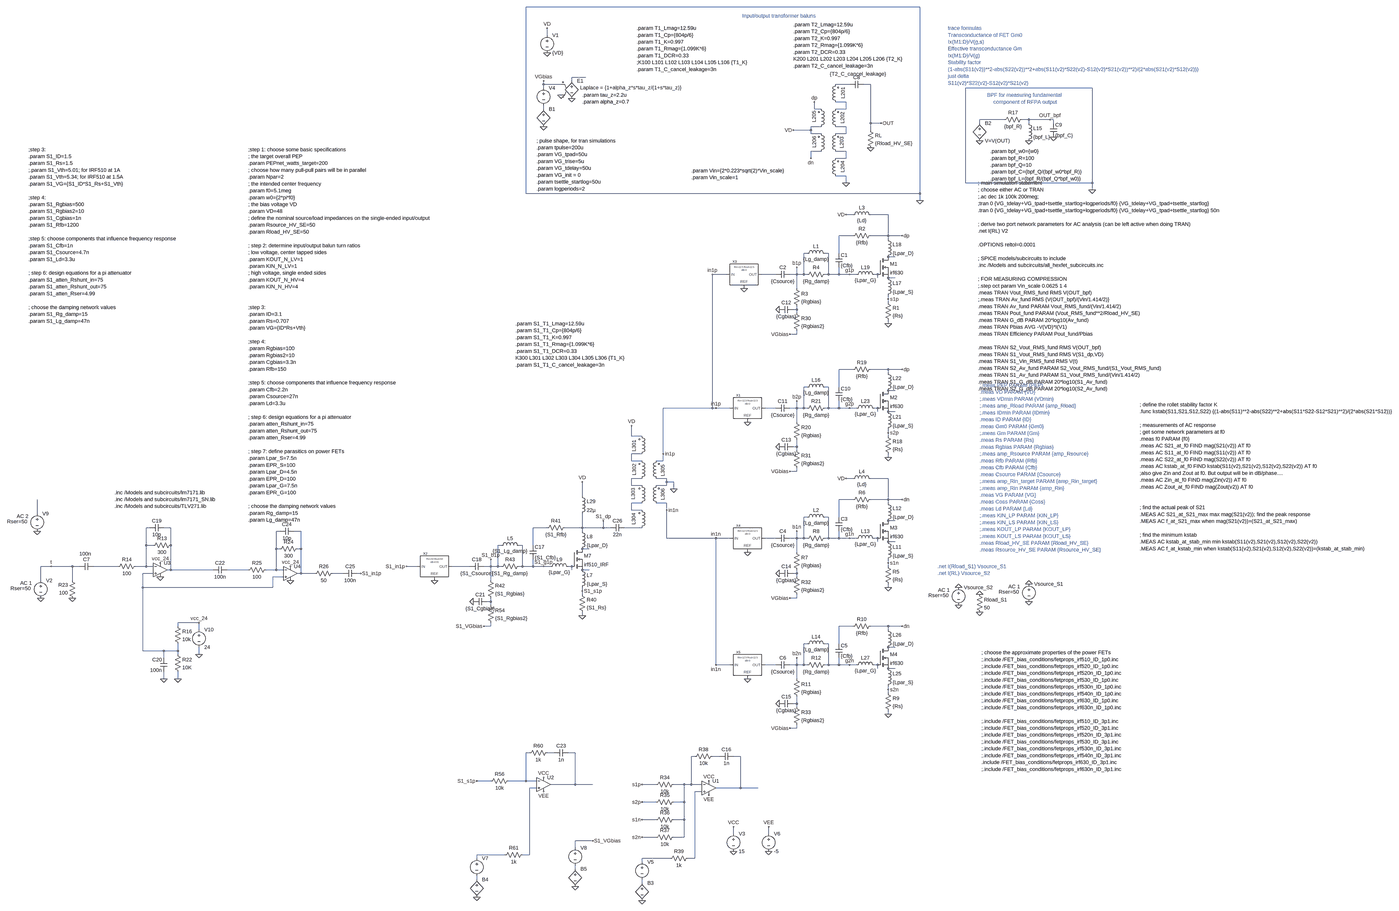
[diagram p0: schematic Easy_RFPA_RevC_seS1.asc, whole sheet]
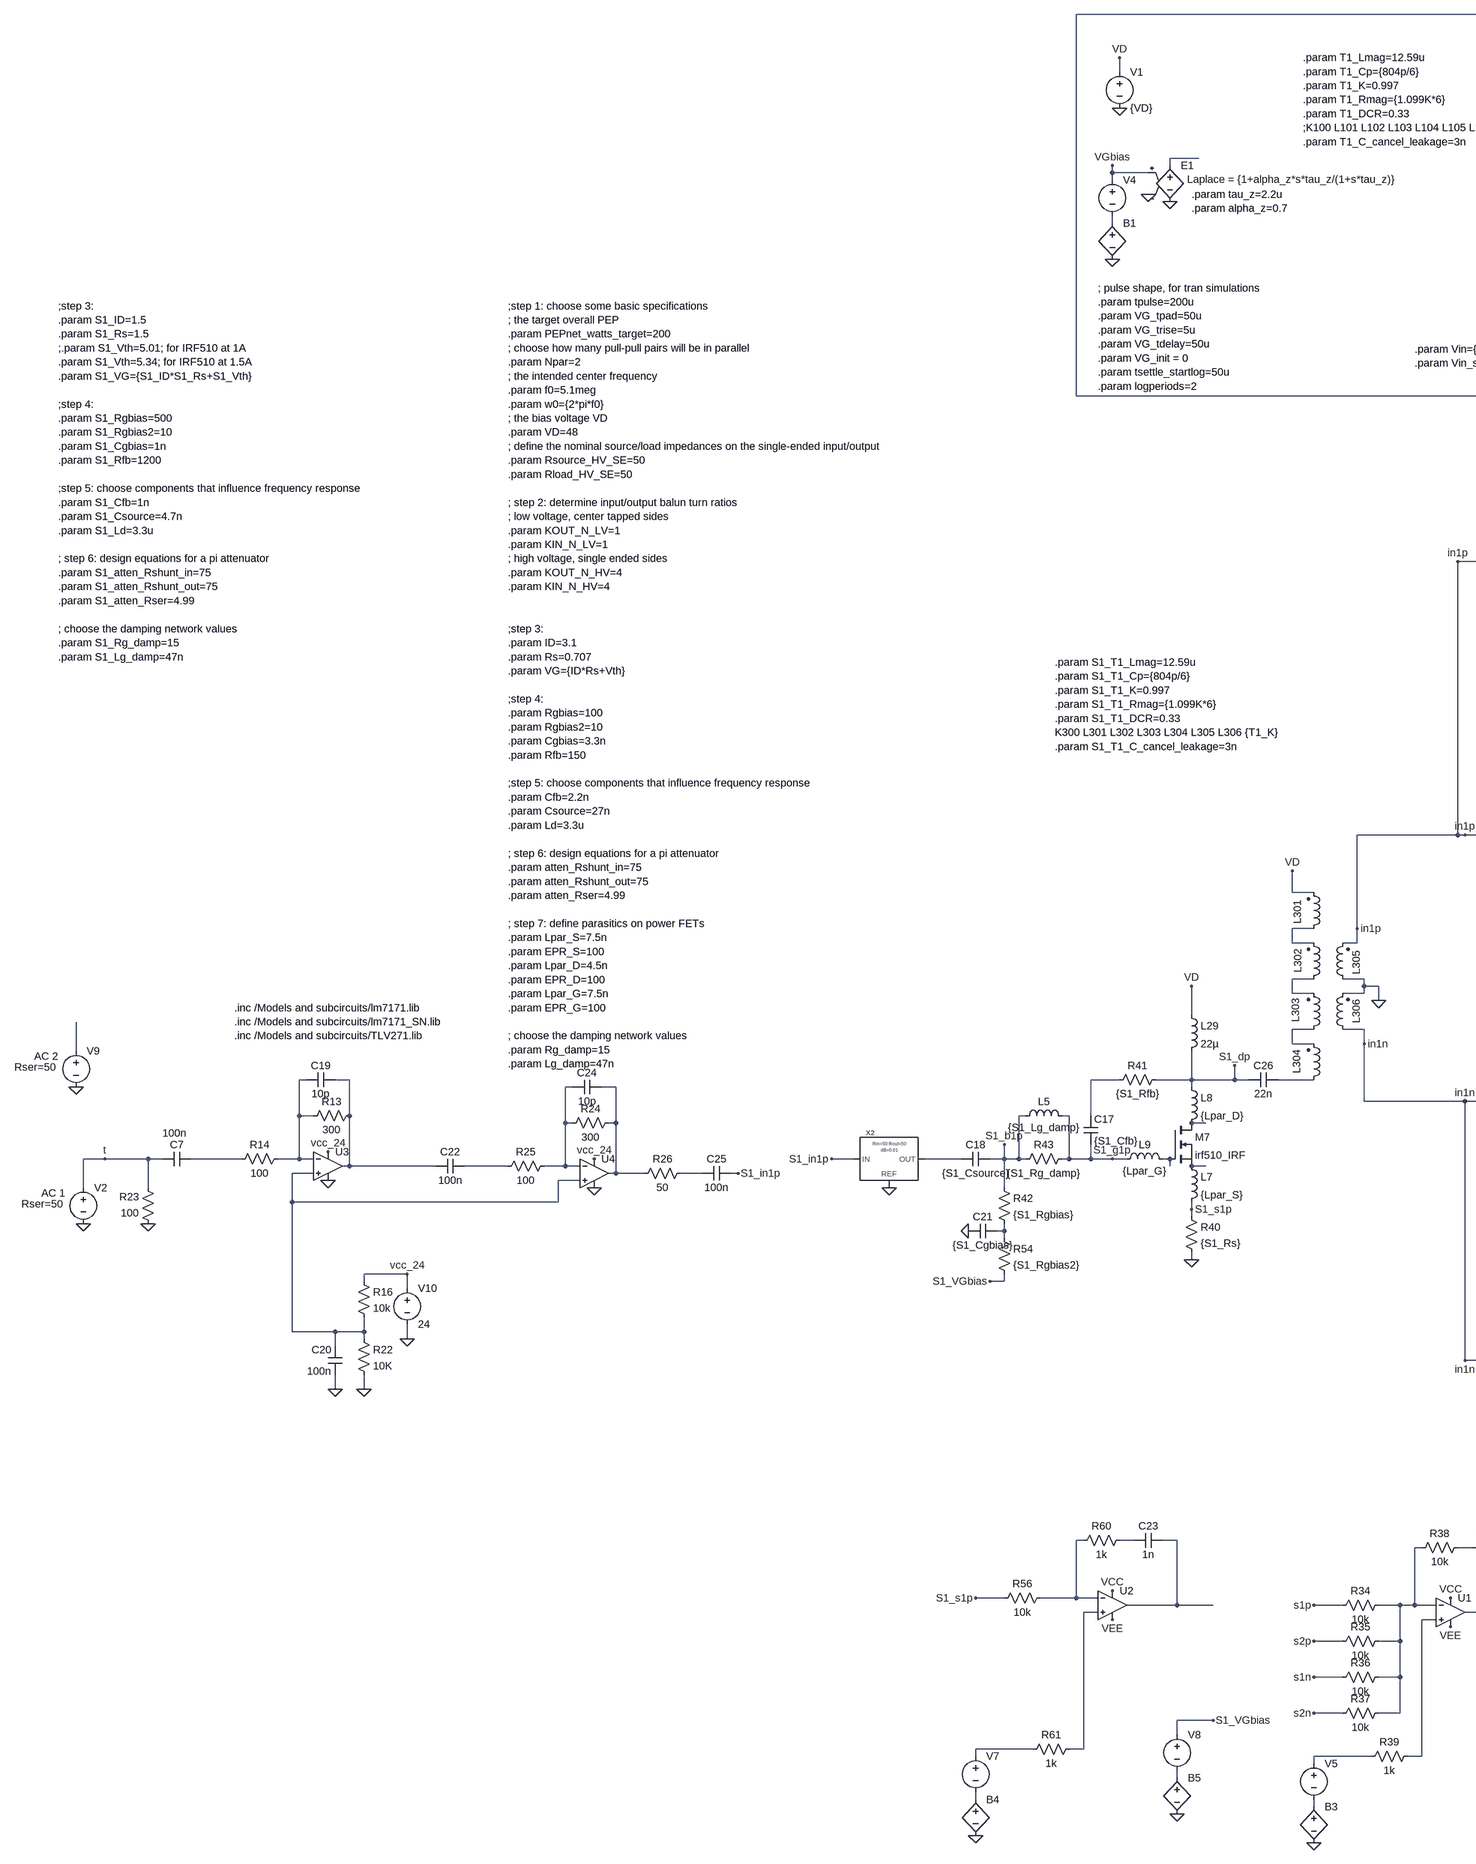
[diagram p1: schematic Easy_RFPA_RevC_seS1.asc, part, row 1 of 1, column 1 of 2]
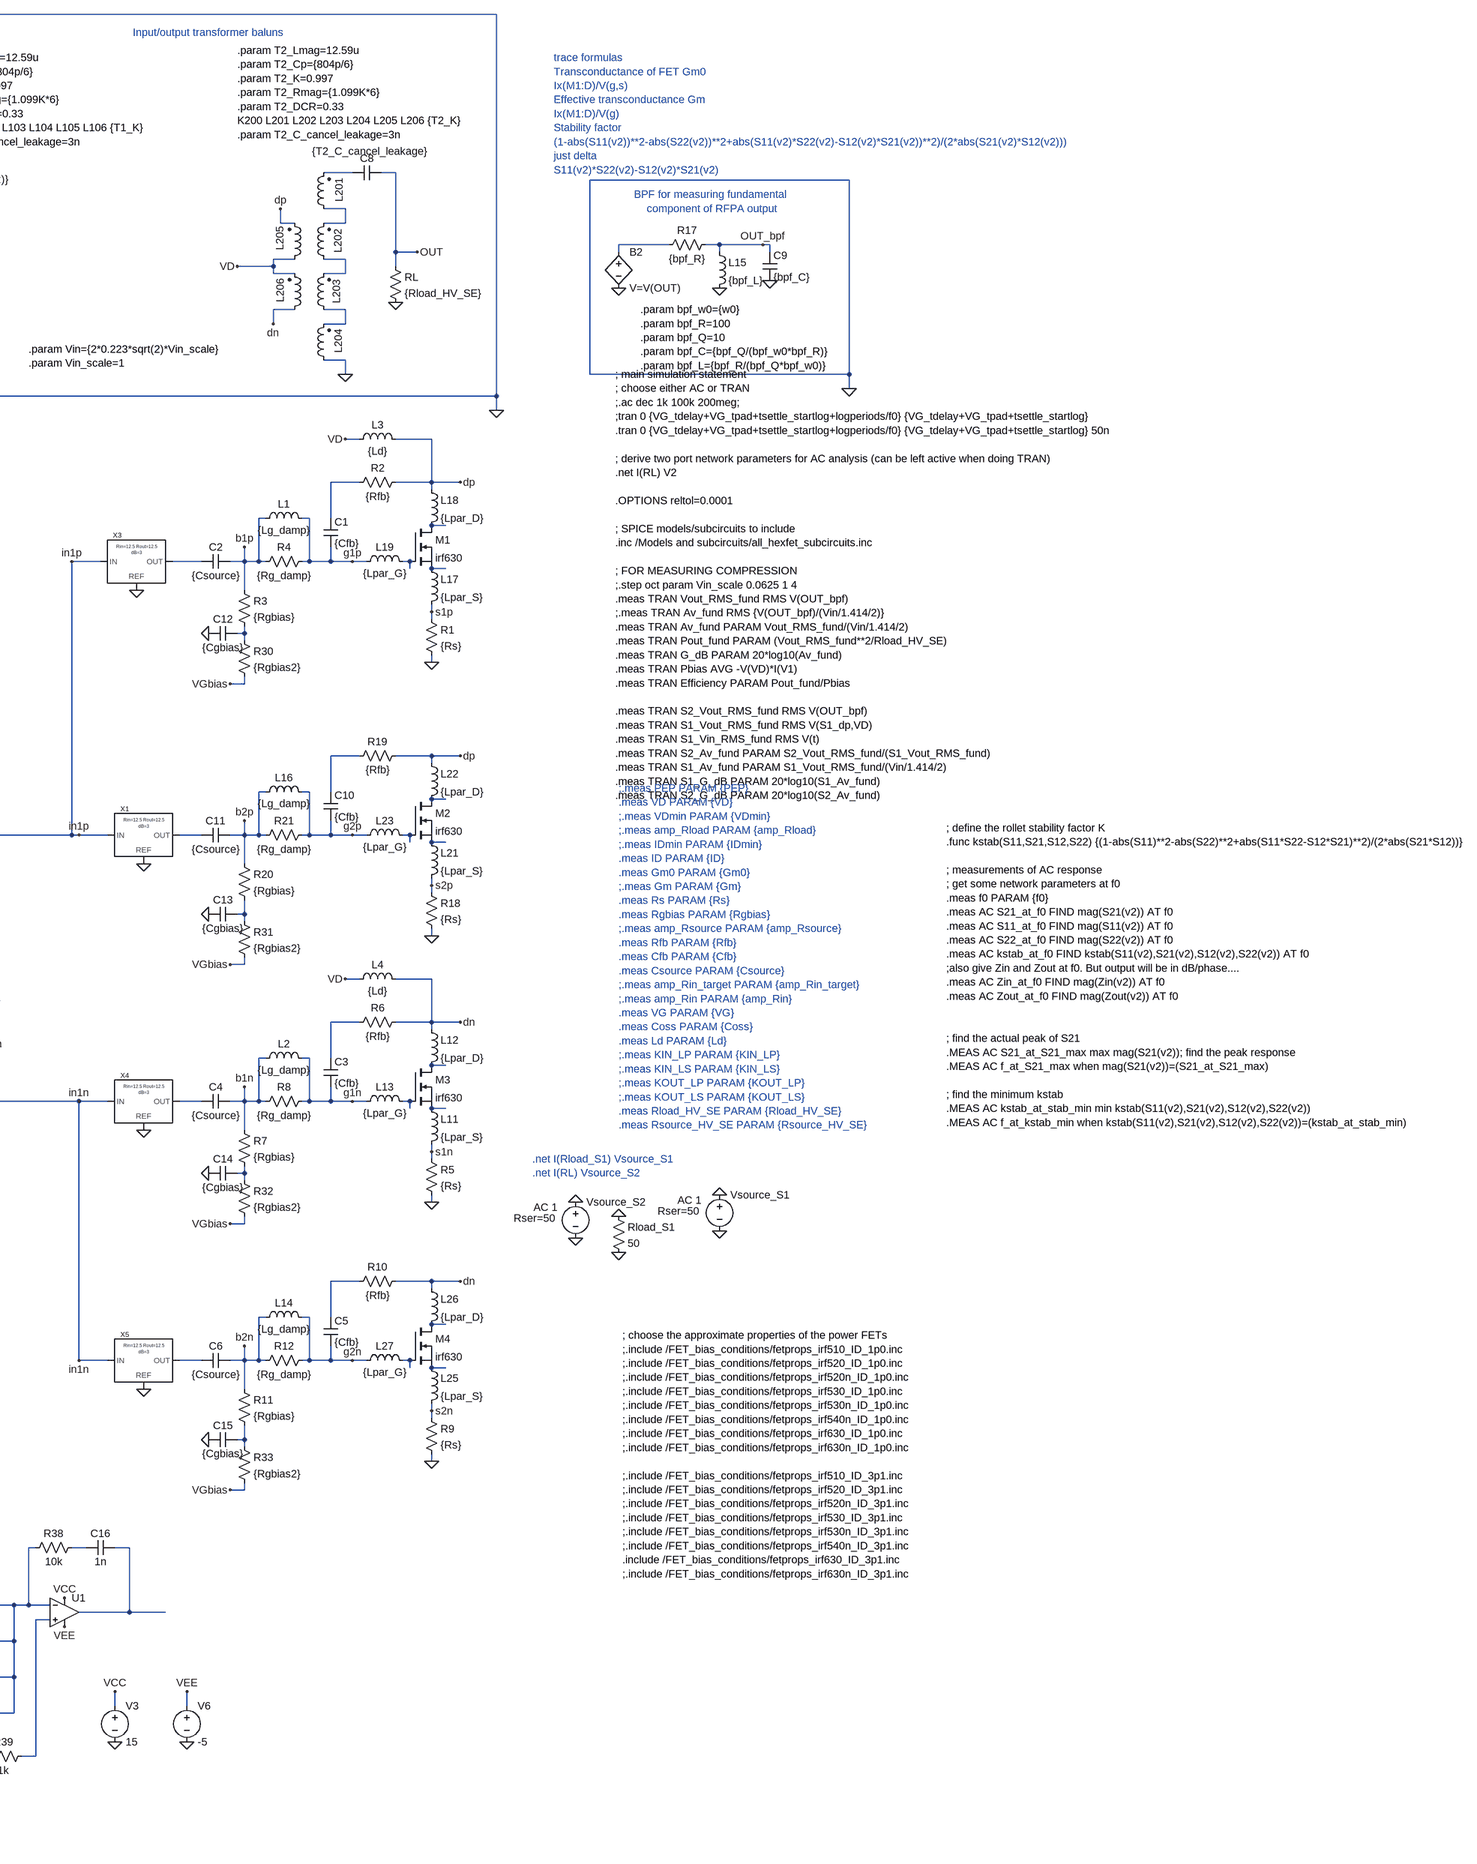
[diagram p2: schematic Easy_RFPA_RevC_seS1.asc, part, row 1 of 1, column 2 of 2]
Easy_RFPA_RevC_seS1.asc, the LTspice schematic file:
Version 4
SHEET 1 5344 3112
WIRE 160 -1280 -1632 -1280
WIRE -1536 -1152 -1536 -1184
WIRE -1360 -960 -1424 -960
WIRE -1424 -944 -1424 -960
WIRE -1552 -928 -1552 -944
WIRE -1472 -928 -1552 -928
WIRE -160 -928 -224 -928
WIRE -64 -928 -96 -928
WIRE -1552 -912 -1552 -928
WIRE 944 -912 368 -912
WIRE -176 -848 -224 -848
WIRE -1552 -816 -1552 -832
WIRE -320 -816 -320 -848
WIRE -288 -816 -320 -816
WIRE -176 -816 -176 -848
WIRE -176 -816 -224 -816
WIRE 544 -768 432 -768
WIRE 656 -768 624 -768
WIRE 752 -768 656 -768
WIRE 768 -768 752 -768
WIRE -64 -752 -64 -928
WIRE -16 -752 -64 -752
WIRE 432 -752 432 -768
WIRE 656 -752 656 -768
WIRE 768 -752 768 -768
WIRE -288 -736 -336 -736
WIRE -176 -736 -224 -736
WIRE -336 -720 -336 -736
WIRE -336 -720 -416 -720
WIRE -64 -720 -64 -752
WIRE -336 -704 -336 -720
WIRE -288 -704 -336 -704
WIRE -176 -704 -176 -736
WIRE -176 -704 -224 -704
WIRE -288 -624 -336 -624
WIRE -176 -624 -224 -624
WIRE -336 -592 -336 -624
WIRE -176 -592 -176 -624
WIRE -176 -592 -224 -592
WIRE -176 -512 -224 -512
WIRE -176 -480 -176 -512
WIRE 368 -480 368 -912
WIRE 944 -480 944 -912
WIRE 944 -480 368 -480
WIRE 944 -448 944 -480
WIRE -1632 -432 -1632 -1280
WIRE 160 -432 160 -1280
WIRE 160 -432 -1632 -432
WIRE 160 -400 160 -432
WIRE -144 -336 -176 -336
WIRE 16 -336 -64 -336
WIRE -144 -240 -208 -240
WIRE 16 -240 16 -336
WIRE 16 -240 -64 -240
WIRE 80 -240 16 -240
WIRE 16 -224 16 -240
WIRE -352 -160 -368 -160
WIRE -256 -160 -272 -160
WIRE -208 -160 -208 -240
WIRE 48 -144 16 -144
WIRE -720 -64 -784 -64
WIRE -496 -64 -560 -64
WIRE -400 -64 -400 -96
WIRE -400 -64 -432 -64
WIRE -368 -64 -368 -160
WIRE -368 -64 -400 -64
WIRE -352 -64 -368 -64
WIRE -256 -64 -256 -160
WIRE -256 -64 -272 -64
WIRE -208 -64 -208 -96
WIRE -208 -64 -256 -64
WIRE -160 -64 -208 -64
WIRE -128 -64 -160 -64
WIRE -32 -64 -48 -64
WIRE -32 -48 -32 -64
WIRE 48 -48 16 -48
WIRE -400 0 -400 -64
WIRE 16 48 16 32
WIRE 16 64 16 48
WIRE -400 96 -400 80
WIRE -400 96 -416 96
WIRE -400 112 -400 96
WIRE 16 160 16 144
WIRE -400 208 -400 192
WIRE -400 208 -432 208
WIRE -144 368 -208 368
WIRE 16 368 -64 368
WIRE 80 368 16 368
WIRE 16 384 16 368
WIRE -352 448 -368 448
WIRE -256 448 -272 448
WIRE -208 448 -208 368
WIRE 48 464 16 464
WIRE -784 544 -784 -64
WIRE -784 544 -1008 544
WIRE -768 544 -784 544
WIRE -704 544 -768 544
WIRE -496 544 -544 544
WIRE -400 544 -400 512
WIRE -400 544 -432 544
WIRE -368 544 -368 448
WIRE -368 544 -400 544
WIRE -352 544 -368 544
WIRE -256 544 -256 448
WIRE -256 544 -272 544
WIRE -208 544 -208 512
WIRE -208 544 -256 544
WIRE -160 544 -208 544
WIRE -128 544 -160 544
WIRE -32 544 -48 544
WIRE -32 560 -32 544
WIRE 48 560 16 560
WIRE -400 608 -400 544
WIRE 16 656 16 640
WIRE -1152 672 -1152 624
WIRE -1104 672 -1152 672
WIRE 16 672 16 656
WIRE -400 720 -400 688
WIRE -400 720 -416 720
WIRE -400 736 -400 720
WIRE -1104 752 -1152 752
WIRE -1008 752 -1008 544
WIRE 16 768 16 752
WIRE -1152 784 -1152 752
WIRE -1104 784 -1152 784
WIRE -1008 784 -1008 752
WIRE -1008 784 -1040 784
WIRE -400 832 -400 816
WIRE -400 832 -432 832
WIRE -1104 864 -1152 864
WIRE -992 864 -1040 864
WIRE -144 864 -176 864
WIRE 16 864 -64 864
WIRE -992 880 -992 864
WIRE -960 880 -992 880
WIRE -1152 896 -1152 864
WIRE -1104 896 -1152 896
WIRE -992 896 -992 880
WIRE -992 896 -1040 896
WIRE -960 912 -960 880
WIRE -1376 944 -1376 880
WIRE -144 960 -208 960
WIRE 16 960 16 864
WIRE 16 960 -64 960
WIRE 80 960 16 960
WIRE -1104 976 -1152 976
WIRE -992 976 -1040 976
WIRE 16 976 16 960
WIRE -1152 1008 -1152 976
WIRE -1104 1008 -1152 1008
WIRE -992 1008 -992 976
WIRE -3856 1024 -3856 960
WIRE -352 1040 -368 1040
WIRE -256 1040 -272 1040
WIRE -208 1040 -208 960
WIRE 48 1056 16 1056
WIRE -3344 1088 -3360 1088
WIRE -3248 1088 -3280 1088
WIRE -1536 1088 -1600 1088
WIRE -1376 1088 -1376 1024
WIRE -1376 1088 -1456 1088
WIRE -1280 1088 -1280 1056
WIRE -1280 1088 -1376 1088
WIRE -1248 1088 -1280 1088
WIRE -1104 1088 -1184 1088
WIRE -2752 1104 -2768 1104
WIRE -2656 1104 -2688 1104
WIRE -1376 1104 -1376 1088
WIRE -992 1136 -992 1008
WIRE -768 1136 -992 1136
WIRE -704 1136 -768 1136
WIRE -496 1136 -544 1136
WIRE -400 1136 -400 1104
WIRE -400 1136 -432 1136
WIRE -368 1136 -368 1040
WIRE -368 1136 -400 1136
WIRE -352 1136 -368 1136
WIRE -256 1136 -256 1040
WIRE -256 1136 -272 1136
WIRE -208 1136 -208 1104
WIRE -208 1136 -256 1136
WIRE -160 1136 -208 1136
WIRE -128 1136 -160 1136
WIRE -32 1136 -48 1136
WIRE -32 1152 -32 1136
WIRE 48 1152 16 1152
WIRE -3360 1168 -3360 1088
WIRE -3328 1168 -3360 1168
WIRE -3248 1168 -3248 1088
WIRE -1744 1168 -1760 1168
WIRE -1648 1168 -1664 1168
WIRE -1600 1168 -1600 1088
WIRE -2768 1184 -2768 1104
WIRE -2752 1184 -2768 1184
WIRE -2656 1184 -2656 1104
WIRE -2656 1184 -2672 1184
WIRE -1344 1184 -1376 1184
WIRE -400 1200 -400 1136
WIRE 16 1248 16 1232
WIRE -3792 1264 -3840 1264
WIRE -3696 1264 -3792 1264
WIRE -3664 1264 -3696 1264
WIRE -3488 1264 -3600 1264
WIRE -3360 1264 -3360 1168
WIRE -3360 1264 -3408 1264
WIRE -3328 1264 -3360 1264
WIRE -2128 1264 -2176 1264
WIRE -1888 1264 -1968 1264
WIRE -1792 1264 -1792 1232
WIRE -1792 1264 -1824 1264
WIRE -1760 1264 -1760 1168
WIRE -1760 1264 -1792 1264
WIRE -1744 1264 -1760 1264
WIRE -1648 1264 -1648 1168
WIRE -1648 1264 -1664 1264
WIRE -1600 1264 -1600 1232
WIRE -1600 1264 -1648 1264
WIRE -1552 1264 -1600 1264
WIRE -1520 1264 -1552 1264
WIRE -1424 1264 -1440 1264
WIRE 16 1264 16 1248
WIRE -3248 1280 -3248 1168
WIRE -3248 1280 -3264 1280
WIRE -3056 1280 -3248 1280
WIRE -2896 1280 -2992 1280
WIRE -2768 1280 -2768 1184
WIRE -2768 1280 -2816 1280
WIRE -2736 1280 -2768 1280
WIRE -1424 1280 -1424 1264
WIRE -1344 1280 -1376 1280
WIRE -3328 1296 -3376 1296
WIRE -2656 1296 -2656 1184
WIRE -2656 1296 -2672 1296
WIRE -2592 1296 -2656 1296
WIRE -2464 1296 -2512 1296
WIRE -2384 1296 -2400 1296
WIRE -400 1296 -400 1280
WIRE -400 1296 -416 1296
WIRE -2736 1312 -2784 1312
WIRE -400 1312 -400 1296
WIRE -3840 1328 -3840 1264
WIRE -3696 1328 -3696 1264
WIRE -1792 1328 -1792 1264
WIRE -3376 1360 -3376 1296
WIRE -2784 1360 -2784 1312
WIRE -2784 1360 -3376 1360
WIRE 16 1360 16 1344
WIRE -1376 1376 -1376 1360
WIRE -1376 1392 -1376 1376
WIRE -400 1408 -400 1392
WIRE -400 1408 -432 1408
WIRE -1792 1424 -1792 1408
WIRE -1792 1424 -1808 1424
WIRE -1792 1440 -1792 1424
WIRE -1376 1488 -1376 1472
WIRE -3120 1520 -3216 1520
WIRE -3216 1536 -3216 1520
WIRE -1792 1536 -1792 1520
WIRE -1792 1536 -1824 1536
WIRE -144 1536 -208 1536
WIRE 16 1536 -64 1536
WIRE 80 1536 16 1536
WIRE -3120 1552 -3120 1520
WIRE 16 1552 16 1536
WIRE -352 1616 -368 1616
WIRE -256 1616 -272 1616
WIRE -208 1616 -208 1536
WIRE 48 1632 16 1632
WIRE -3376 1648 -3376 1360
WIRE -3280 1648 -3376 1648
WIRE -3216 1648 -3216 1616
WIRE -3216 1648 -3280 1648
WIRE -3216 1664 -3216 1648
WIRE -3120 1664 -3120 1632
WIRE -3280 1680 -3280 1648
WIRE -768 1712 -768 1136
WIRE -704 1712 -768 1712
WIRE -496 1712 -544 1712
WIRE -400 1712 -400 1680
WIRE -400 1712 -432 1712
WIRE -368 1712 -368 1616
WIRE -368 1712 -400 1712
WIRE -352 1712 -368 1712
WIRE -256 1712 -256 1616
WIRE -256 1712 -272 1712
WIRE -208 1712 -208 1680
WIRE -208 1712 -256 1712
WIRE -160 1712 -208 1712
WIRE -128 1712 -160 1712
WIRE -32 1712 -48 1712
WIRE -32 1728 -32 1712
WIRE 48 1728 16 1728
WIRE -3280 1776 -3280 1744
WIRE -3216 1776 -3216 1744
WIRE -400 1776 -400 1712
WIRE 16 1824 16 1808
WIRE 16 1840 16 1824
WIRE -400 1888 -400 1856
WIRE -400 1888 -416 1888
WIRE -400 1904 -400 1888
WIRE 16 1936 16 1920
WIRE -400 2000 -400 1984
WIRE -400 2000 -432 2000
WIRE -1616 2112 -1632 2112
WIRE -1504 2112 -1536 2112
WIRE -1408 2112 -1440 2112
WIRE -864 2128 -880 2128
WIRE -752 2128 -784 2128
WIRE -656 2128 -688 2128
WIRE -1792 2240 -1856 2240
WIRE -1632 2240 -1632 2112
WIRE -1632 2240 -1712 2240
WIRE -1584 2240 -1632 2240
WIRE -1408 2256 -1408 2112
WIRE -1408 2256 -1520 2256
WIRE -1328 2256 -1408 2256
WIRE -1040 2256 -1104 2256
WIRE -912 2256 -960 2256
WIRE -880 2256 -880 2128
WIRE -880 2256 -912 2256
WIRE -832 2256 -880 2256
WIRE -1584 2272 -1616 2272
WIRE -656 2272 -656 2128
WIRE -656 2272 -768 2272
WIRE -576 2272 -656 2272
WIRE -832 2288 -864 2288
WIRE -1040 2336 -1104 2336
WIRE -912 2336 -912 2256
WIRE -912 2336 -960 2336
WIRE -1040 2416 -1104 2416
WIRE -912 2416 -912 2336
WIRE -912 2416 -960 2416
WIRE -688 2480 -688 2448
WIRE -528 2480 -528 2448
WIRE -1040 2496 -1104 2496
WIRE -912 2496 -912 2416
WIRE -912 2496 -960 2496
WIRE -1328 2512 -1408 2512
WIRE -1408 2544 -1408 2512
WIRE -1728 2576 -1856 2576
WIRE -1616 2576 -1616 2272
WIRE -1616 2576 -1648 2576
WIRE -1856 2592 -1856 2576
WIRE -976 2592 -1104 2592
WIRE -864 2592 -864 2288
WIRE -864 2592 -896 2592
WIRE -1104 2608 -1104 2592
WIRE -1408 2640 -1408 2624
WIRE -1856 2688 -1856 2672
WIRE -1104 2704 -1104 2688
FLAG 16 160 0
FLAG -3840 1408 0
FLAG -1536 -1072 0
FLAG 80 -240 dp
FLAG -160 -64 g1p
FLAG 16 48 s1p
FLAG -784 -64 in1p
FLAG -400 -96 b1p
FLAG -176 -336 VD
FLAG -432 208 VGbias
FLAG -64 -640 0
FLAG -1536 -1184 VD
FLAG -1552 -944 VGbias
FLAG -16 -752 OUT
FLAG -1552 -736 0
FLAG 432 -672 0
FLAG 656 -672 0
FLAG 768 -688 0
FLAG 752 -768 OUT_bpf
FLAG 16 768 0
FLAG 80 368 dp
FLAG -160 544 g2p
FLAG 16 656 s2p
FLAG -400 512 b2p
FLAG 16 1360 0
FLAG 80 960 dn
FLAG -160 1136 g1n
FLAG 16 1248 s1n
FLAG -400 1104 b1n
FLAG -176 864 VD
FLAG 16 1936 0
FLAG 80 1536 dn
FLAG -160 1712 g2n
FLAG 16 1824 s2n
FLAG -400 1680 b2n
FLAG -768 544 in1p
FLAG -768 1136 in1n
FLAG -768 1712 in1n
FLAG 944 -448 0
FLAG 160 -400 0
FLAG -3792 1264 t
FLAG -176 -480 0
FLAG -320 -848 dp
FLAG -336 -592 dn
FLAG -416 -720 VD
FLAG -480 96 0
FLAG -432 832 VGbias
FLAG -480 720 0
FLAG -432 1408 VGbias
FLAG -480 1296 0
FLAG -432 2000 VGbias
FLAG -480 1888 0
FLAG -1472 -880 0
FLAG -1424 -864 0
FLAG -688 2560 0
FLAG -688 2448 VCC
FLAG -1104 2496 s2n
FLAG -1104 2416 s1n
FLAG -1104 2336 s2p
FLAG -1104 2256 s1p
FLAG -1104 2784 0
FLAG -800 2240 VCC
FLAG -528 2560 0
FLAG -528 2448 VEE
FLAG -800 2304 VEE
FLAG -1376 1488 0
FLAG -1552 1264 S1_g1p
FLAG -1376 1376 S1_s1p
FLAG -2176 1264 S1_in1p
FLAG -1792 1232 S1_b1p
FLAG -1152 624 VD
FLAG -1824 1536 S1_VGbias
FLAG -1872 1424 0
FLAG -1008 752 in1p
FLAG -992 1008 in1n
FLAG -960 912 0
FLAG -1328 2512 S1_VGbias
FLAG -1856 2240 S1_s1p
FLAG -1856 2768 0
FLAG -1552 2224 VCC
FLAG -1552 2288 VEE
FLAG -1280 1056 S1_dp
FLAG -1376 880 VD
FLAG -2048 1328 0
FLAG -1408 2720 0
FLAG 656 1424 0
FLAG 336 1440 0
FLAG 432 1472 0
FLAG 432 1392 0
FLAG 336 1360 0
FLAG 656 1344 0
FLAG -640 0 0
FLAG -624 608 0
FLAG -624 1200 0
FLAG -624 1776 0
FLAG -3120 1520 vcc_24
FLAG -3120 1664 0
FLAG -3216 1776 0
FLAG -3280 1776 0
FLAG -3296 1312 0
FLAG -3696 1408 0
FLAG -3296 1248 vcc_24
FLAG -3856 1104 0
FLAG -2384 1296 S1_in1p
FLAG -2704 1328 0
FLAG -2704 1264 vcc_24
SYMBOL res 0 48 R0
SYMATTR InstName R1
SYMATTR Value {Rs}
SYMBOL res -48 -256 R90
WINDOW 0 0 56 VBottom 2
WINDOW 3 32 56 VTop 2
SYMATTR InstName R2
SYMATTR Value {Rfb}
SYMBOL cap -224 -160 R0
SYMATTR InstName C1
SYMATTR Value {Cfb}
SYMBOL res -416 -16 R0
SYMATTR InstName R3
SYMATTR Value {Rgbias}
SYMBOL res -256 -80 R90
WINDOW 0 0 56 VBottom 2
WINDOW 3 32 56 VTop 2
SYMATTR InstName R4
SYMATTR Value {Rg_damp}
SYMBOL ind -368 -144 R270
WINDOW 0 32 56 VTop 2
WINDOW 3 5 56 VBottom 2
SYMATTR InstName L1
SYMATTR Value {Lg_damp}
SYMBOL cap -432 -80 R90
WINDOW 0 0 32 VBottom 2
WINDOW 3 32 32 VTop 2
SYMATTR InstName C2
SYMATTR Value {Csource}
SYMBOL voltage -1536 -1168 R0
WINDOW 123 0 0 Left 0
WINDOW 39 0 0 Left 0
SYMATTR InstName V1
SYMATTR Value {VD}
SYMBOL ind -160 -320 R270
WINDOW 0 32 56 VTop 2
WINDOW 3 5 56 VBottom 2
SYMATTR InstName L3
SYMATTR Value {Ld}
SYMBOL res -80 -736 R0
SYMATTR InstName RL
SYMATTR Value {Rload_HV_SE}
SYMBOL voltage -1552 -928 R0
WINDOW 3 24 96 Invisible 2
WINDOW 123 0 0 Left 0
WINDOW 39 0 0 Left 0
SYMATTR Value PULSE({VG_init} {VG} {VG_tdelay} {VG_trise} {VG_trise} {VG_tpad*2+tpulse-VG_trise} 10m)
SYMATTR InstName V4
SYMBOL voltage -3840 1312 R0
WINDOW 3 -46 82 Invisible 2
WINDOW 123 -40 28 Right 2
WINDOW 39 -45 52 Right 2
SYMATTR Value SINE(0 {Vin} {f0} {VG_tdelay+VG_tpad} 0 0 {tpulse*f0})
SYMATTR Value2 AC 1
SYMATTR SpiceLine Rser=50
SYMATTR InstName V2
SYMBOL bv -1552 -832 R0
WINDOW 3 24 96 Invisible 2
SYMATTR Value V=VG*smallsig()
SYMATTR InstName B1
SYMBOL bv 432 -768 R0
SYMATTR InstName B2
SYMATTR Value V=V(OUT)
SYMBOL res 640 -784 R90
WINDOW 0 0 56 VBottom 2
WINDOW 3 32 56 VTop 2
SYMATTR InstName R17
SYMATTR Value {bpf_R}
SYMBOL ind 640 -768 R0
SYMATTR InstName L15
SYMATTR Value {bpf_L}
SYMBOL cap 752 -752 R0
SYMATTR InstName C9
SYMATTR Value {bpf_C}
SYMBOL nmos -32 -144 R0
SYMATTR InstName M1
SYMATTR Value irf630
SYMATTR Prefix X
SYMBOL ind 0 -64 R0
SYMATTR InstName L17
SYMATTR Value {Lpar_S}
SYMATTR SpiceLine Rpar={EPR_S}
SYMBOL ind 0 -240 R0
SYMATTR InstName L18
SYMATTR Value {Lpar_D}
SYMATTR SpiceLine Rpar={EPR_D}
SYMBOL ind -144 -48 R270
WINDOW 0 32 56 VTop 2
WINDOW 3 5 56 VBottom 2
SYMATTR InstName L19
SYMATTR Value {Lpar_G}
SYMATTR SpiceLine Rpar={EPR_G}
SYMBOL res 0 656 R0
SYMATTR InstName R18
SYMATTR Value {Rs}
SYMBOL res -48 352 R90
WINDOW 0 0 56 VBottom 2
WINDOW 3 32 56 VTop 2
SYMATTR InstName R19
SYMATTR Value {Rfb}
SYMBOL cap -224 448 R0
SYMATTR InstName C10
SYMATTR Value {Cfb}
SYMBOL res -416 592 R0
SYMATTR InstName R20
SYMATTR Value {Rgbias}
SYMBOL res -256 528 R90
WINDOW 0 0 56 VBottom 2
WINDOW 3 32 56 VTop 2
SYMATTR InstName R21
SYMATTR Value {Rg_damp}
SYMBOL ind -368 464 R270
WINDOW 0 32 56 VTop 2
WINDOW 3 5 56 VBottom 2
SYMATTR InstName L16
SYMATTR Value {Lg_damp}
SYMBOL cap -432 528 R90
WINDOW 0 0 32 VBottom 2
WINDOW 3 32 32 VTop 2
SYMATTR InstName C11
SYMATTR Value {Csource}
SYMBOL nmos -32 464 R0
SYMATTR InstName M2
SYMATTR Value irf630
SYMATTR Prefix X
SYMBOL ind 0 544 R0
SYMATTR InstName L21
SYMATTR Value {Lpar_S}
SYMATTR SpiceLine Rpar={EPR_S}
SYMBOL ind 0 368 R0
SYMATTR InstName L22
SYMATTR Value {Lpar_D}
SYMATTR SpiceLine Rpar={EPR_D}
SYMBOL ind -144 560 R270
WINDOW 0 32 56 VTop 2
WINDOW 3 5 56 VBottom 2
SYMATTR InstName L23
SYMATTR Value {Lpar_G}
SYMATTR SpiceLine Rpar={EPR_G}
SYMBOL res 0 1248 R0
SYMATTR InstName R5
SYMATTR Value {Rs}
SYMBOL res -48 944 R90
WINDOW 0 0 56 VBottom 2
WINDOW 3 32 56 VTop 2
SYMATTR InstName R6
SYMATTR Value {Rfb}
SYMBOL cap -224 1040 R0
SYMATTR InstName C3
SYMATTR Value {Cfb}
SYMBOL res -416 1184 R0
SYMATTR InstName R7
SYMATTR Value {Rgbias}
SYMBOL res -256 1120 R90
WINDOW 0 0 56 VBottom 2
WINDOW 3 32 56 VTop 2
SYMATTR InstName R8
SYMATTR Value {Rg_damp}
SYMBOL ind -368 1056 R270
WINDOW 0 32 56 VTop 2
WINDOW 3 5 56 VBottom 2
SYMATTR InstName L2
SYMATTR Value {Lg_damp}
SYMBOL cap -432 1120 R90
WINDOW 0 0 32 VBottom 2
WINDOW 3 32 32 VTop 2
SYMATTR InstName C4
SYMATTR Value {Csource}
SYMBOL ind -160 880 R270
WINDOW 0 32 56 VTop 2
WINDOW 3 5 56 VBottom 2
SYMATTR InstName L4
SYMATTR Value {Ld}
SYMBOL nmos -32 1056 R0
SYMATTR InstName M3
SYMATTR Value irf630
SYMATTR Prefix X
SYMBOL ind 0 1136 R0
SYMATTR InstName L11
SYMATTR Value {Lpar_S}
SYMATTR SpiceLine Rpar={EPR_S}
SYMBOL ind 0 960 R0
SYMATTR InstName L12
SYMATTR Value {Lpar_D}
SYMATTR SpiceLine Rpar={EPR_D}
SYMBOL ind -144 1152 R270
WINDOW 0 32 56 VTop 2
WINDOW 3 5 56 VBottom 2
SYMATTR InstName L13
SYMATTR Value {Lpar_G}
SYMATTR SpiceLine Rpar={EPR_G}
SYMBOL res 0 1824 R0
SYMATTR InstName R9
SYMATTR Value {Rs}
SYMBOL res -48 1520 R90
WINDOW 0 0 56 VBottom 2
WINDOW 3 32 56 VTop 2
SYMATTR InstName R10
SYMATTR Value {Rfb}
SYMBOL cap -224 1616 R0
SYMATTR InstName C5
SYMATTR Value {Cfb}
SYMBOL res -416 1760 R0
SYMATTR InstName R11
SYMATTR Value {Rgbias}
SYMBOL res -256 1696 R90
WINDOW 0 0 56 VBottom 2
WINDOW 3 32 56 VTop 2
SYMATTR InstName R12
SYMATTR Value {Rg_damp}
SYMBOL ind -368 1632 R270
WINDOW 0 32 56 VTop 2
WINDOW 3 5 56 VBottom 2
SYMATTR InstName L14
SYMATTR Value {Lg_damp}
SYMBOL cap -432 1696 R90
WINDOW 0 0 32 VBottom 2
WINDOW 3 32 32 VTop 2
SYMATTR InstName C6
SYMATTR Value {Csource}
SYMBOL nmos -32 1632 R0
SYMATTR InstName M4
SYMATTR Value irf630
SYMATTR Prefix X
SYMBOL ind 0 1712 R0
SYMATTR InstName L25
SYMATTR Value {Lpar_S}
SYMATTR SpiceLine Rpar={EPR_S}
SYMBOL ind 0 1536 R0
SYMATTR InstName L26
SYMATTR Value {Lpar_D}
SYMATTR SpiceLine Rpar={EPR_D}
SYMBOL ind -144 1728 R270
WINDOW 0 32 56 VTop 2
WINDOW 3 5 56 VBottom 2
SYMATTR InstName L27
SYMATTR Value {Lpar_G}
SYMATTR SpiceLine Rpar={EPR_G}
SYMBOL cap -3664 1280 R270
WINDOW 3 89 27 VBottom 2
WINDOW 0 32 32 VTop 2
SYMATTR Value 100n
SYMATTR InstName C7
SYMBOL ind2 -208 -496 R180
WINDOW 3 36 40 Invisible 2
WINDOW 0 -17 31 VRight 2
SYMATTR Value {T2_Lmag}
SYMATTR InstName L204
SYMATTR Type ind
SYMATTR SpiceLine Rser={T2_DCR} Rpar={T2_Rmag} Cpar={T2_Cp}
SYMBOL ind2 -208 -608 R180
WINDOW 3 36 40 Invisible 2
WINDOW 0 -13 29 VRight 2
SYMATTR Value {T2_Lmag}
SYMATTR InstName L203
SYMATTR Type ind
SYMATTR SpiceLine Rser={T2_DCR} Rpar={T2_Rmag} Cpar={T2_Cp}
SYMBOL ind2 -208 -720 R180
WINDOW 3 36 40 Invisible 2
WINDOW 0 -16 29 VRight 2
SYMATTR Value {T2_Lmag}
SYMATTR InstName L202
SYMATTR Type ind
SYMATTR SpiceLine Rser={T2_DCR} Rpar={T2_Rmag} Cpar={T2_Cp}
SYMBOL ind2 -208 -832 R180
WINDOW 3 36 40 Invisible 2
WINDOW 0 -19 31 VRight 2
SYMATTR Value {T2_Lmag}
SYMATTR InstName L201
SYMATTR Type ind
SYMATTR SpiceLine Rser={T2_DCR} Rpar={T2_Rmag} Cpar={T2_Cp}
SYMBOL ind2 -304 -608 M180
WINDOW 3 36 40 Invisible 2
WINDOW 0 -16 85 VLeft 2
SYMATTR Value {T2_Lmag}
SYMATTR InstName L206
SYMATTR Type ind
SYMATTR SpiceLine Rser={T2_DCR} Rpar={T2_Rmag} Cpar={T2_Cp}
SYMBOL ind2 -304 -720 M180
WINDOW 3 36 40 Invisible 2
WINDOW 0 -17 89 VLeft 2
SYMATTR Value {T2_Lmag}
SYMATTR InstName L205
SYMATTR Type ind
SYMATTR SpiceLine Rser={T2_DCR} Rpar={T2_Rmag} Cpar={T2_Cp}
SYMBOL cap -96 -944 R90
WINDOW 3 -47 25 VTop 2
WINDOW 0 0 32 VBottom 2
SYMATTR Value {T2_C_cancel_leakage}
SYMATTR InstName C8
SYMBOL res -416 96 R0
SYMATTR InstName R30
SYMATTR Value {Rgbias2}
SYMBOL cap -416 80 R90
WINDOW 0 0 32 VBottom 2
WINDOW 3 32 32 VTop 2
SYMATTR InstName C12
SYMATTR Value {Cgbias}
SYMBOL res -416 720 R0
SYMATTR InstName R31
SYMATTR Value {Rgbias2}
SYMBOL cap -416 704 R90
WINDOW 0 0 32 VBottom 2
WINDOW 3 32 32 VTop 2
SYMATTR InstName C13
SYMATTR Value {Cgbias}
SYMBOL res -416 1296 R0
SYMATTR InstName R32
SYMATTR Value {Rgbias2}
SYMBOL cap -416 1280 R90
WINDOW 0 0 32 VBottom 2
WINDOW 3 32 32 VTop 2
SYMATTR InstName C14
SYMATTR Value {Cgbias}
SYMBOL res -416 1888 R0
SYMATTR InstName R33
SYMATTR Value {Rgbias2}
SYMBOL cap -416 1872 R90
WINDOW 0 0 32 VBottom 2
WINDOW 3 32 32 VTop 2
SYMATTR InstName C15
SYMATTR Value {Cgbias}
SYMBOL e -1424 -960 R0
WINDOW 3 38 47 Left 2
SYMATTR InstName E1
SYMATTR Value Laplace = {1+alpha_z*s*tau_z/(1+s*tau_z)}
SYMBOL Opamps\\UniversalOpamp2 -800 2272 R0
SYMATTR InstName U1
SYMATTR Value2 Avol=1Meg GBW=50Meg Slew=10Meg
SYMATTR SpiceLine ilimit=1 rail=0 Vos=0 phimargin=45
SYMBOL voltage -688 2464 R0
WINDOW 123 0 0 Left 0
WINDOW 39 0 0 Left 0
SYMATTR InstName V3
SYMATTR Value 15
SYMBOL res -944 2240 R90
WINDOW 0 0 56 VBottom 2
WINDOW 3 32 56 VTop 2
SYMATTR InstName R34
SYMATTR Value 10k
SYMBOL res -944 2320 R90
WINDOW 0 0 56 VBottom 2
WINDOW 3 32 56 VTop 2
SYMATTR InstName R35
SYMATTR Value 10k
SYMBOL res -944 2400 R90
WINDOW 0 0 56 VBottom 2
WINDOW 3 32 56 VTop 2
SYMATTR InstName R36
SYMATTR Value 10k
SYMBOL res -944 2480 R90
WINDOW 0 0 56 VBottom 2
WINDOW 3 32 56 VTop 2
SYMATTR InstName R37
SYMATTR Value 10k
SYMBOL voltage -1104 2592 R0
WINDOW 3 24 96 Invisible 2
WINDOW 123 0 0 Left 0
WINDOW 39 0 0 Left 0
SYMATTR Value PULSE(0.001 {ID*Rs} {VG_tdelay} {VG_trise} {VG_trise} {VG_tpad*2+tpulse-VG_trise} 10m)
SYMATTR InstName V5
SYMBOL bv -1104 2688 R0
WINDOW 3 24 96 Invisible 2
SYMATTR Value V=ID*Rs*smallsig()
SYMATTR InstName B3
SYMBOL res -768 2112 R90
WINDOW 0 0 56 VBottom 2
WINDOW 3 32 56 VTop 2
SYMATTR InstName R38
SYMATTR Value 10k
SYMBOL res -880 2576 R90
WINDOW 0 0 56 VBottom 2
WINDOW 3 32 56 VTop 2
SYMATTR InstName R39
SYMATTR Value 1k
SYMBOL cap -688 2112 R90
WINDOW 0 0 32 VBottom 2
WINDOW 3 32 32 VTop 2
SYMATTR InstName C16
SYMATTR Value 1n
SYMBOL voltage -528 2464 R0
WINDOW 123 0 0 Left 0
WINDOW 39 0 0 Left 0
SYMATTR InstName V6
SYMATTR Value -5
SYMBOL res -1392 1376 R0
SYMATTR InstName R40
SYMATTR Value {S1_Rs}
SYMBOL res -1440 1072 R90
WINDOW 0 0 56 VBottom 2
WINDOW 3 32 56 VTop 2
SYMATTR InstName R41
SYMATTR Value {S1_Rfb}
SYMBOL cap -1616 1168 R0
SYMATTR InstName C17
SYMATTR Value {S1_Cfb}
SYMBOL res -1808 1312 R0
SYMATTR InstName R42
SYMATTR Value {S1_Rgbias}
SYMBOL res -1648 1248 R90
WINDOW 0 0 56 VBottom 2
WINDOW 3 32 56 VTop 2
SYMATTR InstName R43
SYMATTR Value {S1_Rg_damp}
SYMBOL ind -1760 1184 R270
WINDOW 0 32 56 VTop 2
WINDOW 3 5 56 VBottom 2
SYMATTR InstName L5
SYMATTR Value {S1_Lg_damp}
SYMBOL cap -1888 1248 M90
WINDOW 0 0 32 VBottom 2
WINDOW 3 32 32 VTop 2
SYMATTR InstName C18
SYMATTR Value {S1_Csource}
SYMBOL ind -1392 1264 R0
SYMATTR InstName L7
SYMATTR Value {Lpar_S}
SYMATTR SpiceLine Rpar={EPR_S}
SYMBOL ind -1392 1088 R0
SYMATTR InstName L8
SYMATTR Value {Lpar_D}
SYMATTR SpiceLine Rpar={EPR_D}
SYMBOL ind -1536 1280 R270
WINDOW 0 32 56 VTop 2
WINDOW 3 5 56 VBottom 2
SYMATTR InstName L9
SYMATTR Value {Lpar_G}
SYMATTR SpiceLine Rpar={EPR_G}
SYMBOL res -1808 1424 R0
SYMATTR InstName R54
SYMATTR Value {S1_Rgbias2}
SYMBOL cap -1808 1408 R90
WINDOW 0 0 32 VBottom 2
WINDOW 3 32 32 VTop 2
SYMATTR InstName C21
SYMATTR Value {S1_Cgbias}
SYMBOL ind2 -1120 1104 M180
WINDOW 3 36 40 Invisible 2
WINDOW 0 -22 83 VLeft 2
SYMATTR Value {S1_T1_Lmag}
SYMATTR InstName L304
SYMATTR Type ind
SYMATTR SpiceLine Rser={S1_T1_DCR} Rpar={S1_T1_Rmag} Cpar={S1_T1_Cp}
SYMBOL ind2 -1120 992 M180
WINDOW 3 36 40 Invisible 2
WINDOW 0 -24 85 VLeft 2
SYMATTR Value {S1_T1_Lmag}
SYMATTR InstName L303
SYMATTR Type ind
SYMATTR SpiceLine Rser={S1_T1_DCR} Rpar={S1_T1_Rmag} Cpar={S1_T1_Cp}
SYMBOL ind2 -1120 880 M180
WINDOW 3 36 40 Invisible 2
WINDOW 0 -19 83 VLeft 2
SYMATTR Value {S1_T1_Lmag}
SYMATTR InstName L302
SYMATTR Type ind
SYMATTR SpiceLine Rser={S1_T1_DCR} Rpar={S1_T1_Rmag} Cpar={S1_T1_Cp}
SYMBOL ind2 -1120 768 M180
WINDOW 3 36 40 Invisible 2
WINDOW 0 -20 80 VLeft 2
SYMATTR Value {S1_T1_Lmag}
SYMATTR InstName L301
SYMATTR Type ind
SYMATTR SpiceLine Rser={S1_T1_DCR} Rpar={S1_T1_Rmag} Cpar={S1_T1_Cp}
SYMBOL ind2 -1024 992 R180
WINDOW 3 36 40 Invisible 2
WINDOW 0 -15 29 VRight 2
SYMATTR Value {S1_T1_Lmag}
SYMATTR InstName L306
SYMATTR Type ind
SYMATTR SpiceLine Rser={S1_T1_DCR} Rpar={S1_T1_Rmag} Cpar={S1_T1_Cp}
SYMBOL ind2 -1024 880 R180
WINDOW 3 36 40 Invisible 2
WINDOW 0 -15 25 VRight 2
SYMATTR Value {S1_T1_Lmag}
SYMATTR InstName L305
SYMATTR Type ind
SYMATTR SpiceLine Rser={S1_T1_DCR} Rpar={S1_T1_Rmag} Cpar={S1_T1_Cp}
SYMBOL Opamps\\UniversalOpamp2 -1552 2256 R0
SYMATTR InstName U2
SYMATTR Value2 Avol=1Meg GBW=50Meg Slew=10Meg
SYMATTR SpiceLine ilimit=1 rail=0 Vos=0 phimargin=45
SYMBOL res -1696 2224 R90
WINDOW 0 0 56 VBottom 2
WINDOW 3 32 56 VTop 2
SYMATTR InstName R56
SYMATTR Value 10k
SYMBOL voltage -1856 2576 R0
WINDOW 3 24 96 Invisible 2
WINDOW 123 0 0 Left 0
WINDOW 39 0 0 Left 0
SYMATTR Value PULSE(0.001 {S1_ID*S1_Rs} {VG_tdelay} {VG_trise} {VG_trise} {VG_tpad*2+tpulse-VG_trise} 10m)
SYMATTR InstName V7
SYMBOL bv -1856 2672 R0
WINDOW 3 24 96 Invisible 2
SYMATTR Value V=S1_ID*S1_Rs*smallsig()
SYMATTR InstName B4
SYMBOL res -1520 2096 R90
WINDOW 0 0 56 VBottom 2
WINDOW 3 32 56 VTop 2
SYMATTR InstName R60
SYMATTR Value 1k
SYMBOL res -1632 2560 R90
WINDOW 0 0 56 VBottom 2
WINDOW 3 32 56 VTop 2
SYMATTR InstName R61
SYMATTR Value 1k
SYMBOL cap -1440 2096 R90
WINDOW 0 0 32 VBottom 2
WINDOW 3 32 32 VTop 2
SYMATTR InstName C23
SYMATTR Value 1n
SYMBOL ind -1392 928 R0
SYMATTR InstName L29
SYMATTR Value 22µ
SYMBOL nmos -1424 1184 R0
SYMATTR InstName M7
SYMATTR Value irf510_IRF
SYMATTR Prefix X
SYMBOL res 416 1376 R0
SYMATTR InstName Rload_S1
SYMATTR Value 50
SYMBOL voltage -1408 2528 R0
WINDOW 3 24 96 Invisible 2
WINDOW 123 0 0 Left 0
WINDOW 39 0 0 Left 0
SYMATTR Value PULSE({VG_init} {S1_VG} {VG_tdelay} {VG_trise} {VG_trise} {VG_tpad*2+tpulse-VG_trise} 10m)
SYMATTR InstName V8
SYMBOL bv -1408 2624 R0
WINDOW 3 24 96 Invisible 2
SYMATTR Value V=S1_VG*smallsig()
SYMATTR InstName B5
SYMBOL voltage 656 1328 R0
WINDOW 3 -46 82 Invisible 2
WINDOW 123 -40 28 Right 2
WINDOW 39 -45 52 Right 2
SYMATTR Value 0
SYMATTR Value2 AC 1
SYMATTR SpiceLine Rser=50
SYMATTR InstName Vsource_S1
SYMBOL voltage 336 1344 R0
WINDOW 3 -46 82 Invisible 2
WINDOW 123 -40 28 Right 2
WINDOW 39 -45 52 Right 2
SYMATTR Value 0
SYMATTR Value2 AC 1
SYMATTR SpiceLine Rser=50
SYMATTR InstName Vsource_S2
SYMBOL atten -640 -48 R0
SYMATTR InstName X3
SYMATTR SpiceLine Rin=12.5 Rout=12.5
SYMATTR SpiceLine2 dB=3
SYMBOL atten -624 560 R0
SYMATTR InstName X1
SYMATTR SpiceLine Rin=12.5 Rout=12.5
SYMATTR SpiceLine2 dB=3
SYMBOL atten -624 1152 R0
SYMATTR InstName X4
SYMATTR SpiceLine Rin=12.5 Rout=12.5
SYMATTR SpiceLine2 dB=3
SYMBOL atten -624 1728 R0
SYMATTR InstName X5
SYMATTR SpiceLine Rin=12.5 Rout=12.5
SYMATTR SpiceLine2 dB=3
SYMBOL atten -2048 1280 R0
SYMATTR InstName X2
SYMATTR SpiceLine2 dB=0.01
SYMBOL voltage -3120 1536 R0
WINDOW 123 0 0 Left 0
WINDOW 39 0 0 Left 0
SYMATTR InstName V10
SYMATTR Value 24
SYMBOL res -3232 1152 R90
WINDOW 0 0 56 VBottom 2
WINDOW 3 32 56 VTop 2
SYMATTR InstName R13
SYMATTR Value 300
SYMBOL res -3392 1248 R90
WINDOW 0 0 56 VBottom 2
WINDOW 3 32 56 VTop 2
SYMATTR InstName R14
SYMATTR Value 100
SYMBOL cap -3280 1072 R90
WINDOW 0 0 32 VBottom 2
WINDOW 3 32 32 VTop 2
SYMATTR InstName C19
SYMATTR Value 10p
SYMBOL res -3232 1520 R0
SYMATTR InstName R16
SYMATTR Value 10k
SYMBOL res -3232 1648 R0
SYMATTR InstName R22
SYMATTR Value 10K
SYMBOL cap -3264 1744 R180
WINDOW 0 24 56 Left 2
WINDOW 3 24 8 Left 2
SYMATTR InstName C20
SYMATTR Value 100n
SYMBOL cap -2992 1264 R90
WINDOW 0 0 32 VBottom 2
WINDOW 3 32 32 VTop 2
SYMATTR InstName C22
SYMATTR Value 100n
SYMBOL res -3680 1424 R180
WINDOW 0 36 76 Left 2
WINDOW 3 36 40 Left 2
SYMATTR InstName R23
SYMATTR Value 100
SYMBOL Opamps\\UniversalOpamp2 -3296 1280 R0
SYMATTR InstName U3
SYMATTR Value2 Avol=5.6K GBW=160Meg Slew=100Meg
SYMATTR SpiceLine ilimit=120m rail=0 Vos=0 phimargin=45
SYMBOL voltage -3856 1008 R0
WINDOW 3 -46 82 Invisible 2
WINDOW 123 -40 28 Right 2
WINDOW 39 -45 52 Right 2
SYMATTR Value SINE(0 {Vin} {f0} {VG_tdelay+VG_tpad} 0 0 {tpulse*f0})
SYMATTR Value2 AC 2
SYMATTR SpiceLine Rser=50
SYMATTR InstName V9
SYMBOL res -2656 1168 R90
WINDOW 0 0 56 VBottom 2
WINDOW 3 32 56 VTop 2
SYMATTR InstName R24
SYMATTR Value 300
SYMBOL res -2800 1264 R90
WINDOW 0 0 56 VBottom 2
WINDOW 3 32 56 VTop 2
SYMATTR InstName R25
SYMATTR Value 100
SYMBOL res -2496 1280 R90
WINDOW 0 0 56 VBottom 2
WINDOW 3 32 56 VTop 2
SYMATTR InstName R26
SYMATTR Value 50
SYMBOL cap -2688 1088 R90
WINDOW 0 0 32 VBottom 2
WINDOW 3 32 32 VTop 2
SYMATTR InstName C24
SYMATTR Value 10p
SYMBOL cap -2400 1280 R90
WINDOW 0 0 32 VBottom 2
WINDOW 3 32 32 VTop 2
SYMATTR InstName C25
SYMATTR Value 100n
SYMBOL Opamps\\UniversalOpamp2 -2704 1296 R0
SYMATTR InstName U4
SYMATTR Value2 Avol=5.6K GBW=160Meg Slew=100Meg
SYMATTR SpiceLine ilimit=120m rail=0 Vos=0 phimargin=45
SYMBOL cap -1184 1072 R90
WINDOW 0 0 32 VBottom 2
WINDOW 3 32 32 VTop 2
SYMATTR InstName C26
SYMATTR Value 22n
TEXT 424 -480 Left 2 !; main simulation statement\n; choose either AC or TRAN\n;.ac dec 1k 100k 200meg;\n;tran 0 {VG_tdelay+VG_tpad+tsettle_startlog+logperiods/f0} {VG_tdelay+VG_tpad+tsettle_startlog}\n.tran 0 {VG_tdelay+VG_tpad+tsettle_startlog+logperiods/f0} {VG_tdelay+VG_tpad+tsettle_startlog} 50n\n \n; derive two port network parameters for AC analysis (can be left active when doing TRAN)\n.net I(RL) V2\n \n.OPTIONS reltol=0.0001\n \n; SPICE models/subcircuits to include\n.inc /Models and subcircuits/all_hexfet_subcircuits.inc\n \n; FOR MEASURING COMPRESSION\n;.step oct param Vin_scale 0.0625 1 4\n.meas TRAN Vout_RMS_fund RMS V(OUT_bpf)\n;.meas TRAN Av_fund RMS {V(OUT_bpf)/(Vin/1.414/2)}\n.meas TRAN Av_fund PARAM Vout_RMS_fund/(Vin/1.414/2)\n.meas TRAN Pout_fund PARAM (Vout_RMS_fund**2/Rload_HV_SE)\n.meas TRAN G_dB PARAM 20*log10(Av_fund)\n.meas TRAN Pbias AVG -V(VD)*I(V1)\n.meas TRAN Efficiency PARAM Pout_fund/Pbias\n \n.meas TRAN S2_Vout_RMS_fund RMS V(OUT_bpf)\n.meas TRAN S1_Vout_RMS_fund RMS V(S1_dp,VD)\n.meas TRAN S1_Vin_RMS_fund RMS V(t)\n.meas TRAN S2_Av_fund PARAM S2_Vout_RMS_fund/(S1_Vout_RMS_fund)\n.meas TRAN S1_Av_fund PARAM S1_Vout_RMS_fund/(Vin/1.414/2)\n.meas TRAN S1_G_dB PARAM 20*log10(S1_Av_fund)\n.meas TRAN S2_G_dB PARAM 20*log10(S2_Av_fund)
TEXT 288 -1184 Left 2 ;trace formulas\nTransconductance of FET Gm0\nIx(M1:D)/V(g,s)\nEffective transconductance Gm\nIx(M1:D)/V(g)\nStability factor\n(1-abs(S11(v2))**2-abs(S22(v2))**2+abs(S11(v2)*S22(v2)-S12(v2)*S21(v2))**2)/(2*abs(S21(v2)*S12(v2)))\njust delta\nS11(v2)*S22(v2)-S12(v2)*S21(v2)
TEXT -2896 -632 Left 2 !;step 1: choose some basic specifications\n; the target overall PEP\n.param PEPnet_watts_target=200\n; choose how many pull-pull pairs will be in parallel\n.param Npar=2\n; the intended center frequency\n.param f0=5.1meg\n.param w0={2*pi*f0}\n; the bias voltage VD\n.param VD=48\n; define the nominal source/load impedances on the single-ended input/output \n.param Rsource_HV_SE=50\n.param Rload_HV_SE=50\n \n; step 2: determine input/output balun turn ratios\n; low voltage, center tapped sides\n.param KOUT_N_LV=1\n.param KIN_N_LV=1\n; high voltage, single ended sides\n.param KOUT_N_HV=4\n.param KIN_N_HV=4\n \n \n;step 3:\n.param ID=3.1\n.param Rs=0.707\n.param VG={ID*Rs+Vth}\n \n;step 4:\n.param Rgbias=100\n.param Rgbias2=10\n.param Cgbias=3.3n\n.param Rfb=150\n \n;step 5: choose components that influence frequency response\n.param Cfb=2.2n\n.param Csource=27n\n.param Ld=3.3u\n \n; step 6: design equations for a pi attenuator\n.param atten_Rshunt_in=75\n.param atten_Rshunt_out=75\n.param atten_Rser=4.99\n \n; step 7: define parasitics on power FETs\n.param Lpar_S=7.5n\n.param EPR_S=100\n.param Lpar_D=4.5n\n.param EPR_D=100\n.param Lpar_G=7.5n\n.param EPR_G=100\n \n; choose the damping network values\n.param Rg_damp=15\n.param Lg_damp=47n
TEXT 432 440 Left 2 ;;.meas PEP PARAM {PEP}\n.meas VD PARAM {VD}\n;.meas VDmin PARAM {VDmin}\n;.meas amp_Rload PARAM {amp_Rload}\n;.meas IDmin PARAM {IDmin}\n.meas ID PARAM {ID}\n.meas Gm0 PARAM {Gm0}\n;.meas Gm PARAM {Gm}\n.meas Rs PARAM {Rs}\n.meas Rgbias PARAM {Rgbias}\n;.meas amp_Rsource PARAM {amp_Rsource}\n.meas Rfb PARAM {Rfb}\n.meas Cfb PARAM {Cfb}\n.meas Csource PARAM {Csource}\n;.meas amp_Rin_target PARAM {amp_Rin_target}\n;.meas amp_Rin PARAM {amp_Rin}\n.meas VG PARAM {VG}\n.meas Coss PARAM {Coss}\n.meas Ld PARAM {Ld}\n;.meas KIN_LP PARAM {KIN_LP}\n;.meas KIN_LS PARAM {KIN_LS}\n;.meas KOUT_LP PARAM {KOUT_LP}\n;.meas KOUT_LS PARAM {KOUT_LS}\n.meas Rload_HV_SE PARAM {Rload_HV_SE}\n.meas Rsource_HV_SE PARAM {Rsource_HV_SE}
TEXT -1584 -672 Left 2 !; pulse shape, for tran simulations\n.param tpulse=200u\n.param VG_tpad=50u\n.param VG_trise=5u\n.param VG_tdelay=50u\n.param VG_init = 0\n.param tsettle_startlog=50u\n.param logperiods=2
TEXT 480 -624 Left 2 !.param bpf_w0={w0}\n.param bpf_R=100\n.param bpf_Q=10\n.param bpf_C={bpf_Q/(bpf_w0*bpf_R)}\n.param bpf_L={bpf_R/(bpf_Q*bpf_w0)}
TEXT 640 -864 Center 2 ;BPF for measuring fundamental \ncomponent of RFPA output
TEXT -648 -1240 Left 2 ;Input/output transformer baluns
TEXT 440 1656 Left 2 !; choose the approximate properties of the power FETs\n;.include /FET_bias_conditions/fetprops_irf510_ID_1p0.inc\n;.include /FET_bias_conditions/fetprops_irf520_ID_1p0.inc\n;.include /FET_bias_conditions/fetprops_irf520n_ID_1p0.inc\n;.include /FET_bias_conditions/fetprops_irf530_ID_1p0.inc\n;.include /FET_bias_conditions/fetprops_irf530n_ID_1p0.inc\n;.include /FET_bias_conditions/fetprops_irf540n_ID_1p0.inc\n;.include /FET_bias_conditions/fetprops_irf630_ID_1p0.inc\n;.include /FET_bias_conditions/fetprops_irf630n_ID_1p0.inc\n \n;.include /FET_bias_conditions/fetprops_irf510_ID_3p1.inc\n;.include /FET_bias_conditions/fetprops_irf520_ID_3p1.inc\n;.include /FET_bias_conditions/fetprops_irf520n_ID_3p1.inc\n;.include /FET_bias_conditions/fetprops_irf530_ID_3p1.inc\n;.include /FET_bias_conditions/fetprops_irf530n_ID_3p1.inc\n;.include /FET_bias_conditions/fetprops_irf540n_ID_3p1.inc\n.include /FET_bias_conditions/fetprops_irf630_ID_3p1.inc\n;.include /FET_bias_conditions/fetprops_irf630n_ID_3p1.inc
TEXT 1160 528 Left 2 !; define the rollet stability factor K\n.func kstab(S11,S21,S12,S22) {(1-abs(S11)**2-abs(S22)**2+abs(S11*S22-S12*S21)**2)/(2*abs(S21*S12))}\n \n; measurements of AC response\n; get some network parameters at f0\n.meas f0 PARAM {f0}\n.meas AC S21_at_f0 FIND mag(S21(v2)) AT f0\n.meas AC S11_at_f0 FIND mag(S11(v2)) AT f0\n.meas AC S22_at_f0 FIND mag(S22(v2)) AT f0\n.meas AC kstab_at_f0 FIND kstab(S11(v2),S21(v2),S12(v2),S22(v2)) AT f0\n;also give Zin and Zout at f0. But output will be in dB/phase....\n.meas AC Zin_at_f0 FIND mag(Zin(v2)) AT f0\n.meas AC Zout_at_f0 FIND mag(Zout(v2)) AT f0\n \n \n; find the actual peak of S21\n.MEAS AC S21_at_S21_max max mag(S21(v2)); find the peak response\n.MEAS AC f_at_S21_max when mag(S21(v2))=(S21_at_S21_max)\n \n; find the minimum kstab\n.MEAS AC kstab_at_stab_min min kstab(S11(v2),S21(v2),S12(v2),S22(v2))\n.MEAS AC f_at_kstab_min when kstab(S11(v2),S21(v2),S12(v2),S22(v2))=(kstab_at_stab_min)
TEXT -416 -1200 Left 2 !.param T2_Lmag=12.59u\n.param T2_Cp={804p/6}\n.param T2_K=0.997\n.param T2_Rmag={1.099K*6}\n.param T2_DCR=0.33\nK200 L201 L202 L203 L204 L205 L206 {T2_K}\n.param T2_C_cancel_leakage=3n
TEXT -1128 -1184 Left 2 !.param T1_Lmag=12.59u\n.param T1_Cp={804p/6}\n.param T1_K=0.997\n.param T1_Rmag={1.099K*6}\n.param T1_DCR=0.33\n;K100 L101 L102 L103 L104 L105 L106 {T1_K}\n.param T1_C_cancel_leakage=3n
TEXT -880 -536 Left 2 !.param Vin={2*0.223*sqrt(2)*Vin_scale}\n.param Vin_scale=1
TEXT -1376 -880 Left 2 !.param tau_z=2.2u\n.param alpha_z=0.7
TEXT -3896 -632 Left 2 !;step 3:\n.param S1_ID=1.5\n.param S1_Rs=1.5\n;.param S1_Vth=5.01; for IRF510 at 1A\n.param S1_Vth=5.34; for IRF510 at 1.5A\n.param S1_VG={S1_ID*S1_Rs+S1_Vth}\n \n;step 4:\n.param S1_Rgbias=500\n.param S1_Rgbias2=10\n.param S1_Cgbias=1n\n.param S1_Rfb=1200\n \n;step 5: choose components that influence frequency response\n.param S1_Cfb=1n\n.param S1_Csource=4.7n\n.param S1_Ld=3.3u\n \n; step 6: design equations for a pi attenuator\n.param S1_atten_Rshunt_in=75\n.param S1_atten_Rshunt_out=75\n.param S1_atten_Rser=4.99\n \n; choose the damping network values\n.param S1_Rg_damp=15\n.param S1_Lg_damp=47n
TEXT -1680 160 Left 2 !.param S1_T1_Lmag=12.59u\n.param S1_T1_Cp={804p/6}\n.param S1_T1_K=0.997\n.param S1_T1_Rmag={1.099K*6}\n.param S1_T1_DCR=0.33\nK300 L301 L302 L303 L304 L305 L306 {T1_K}\n.param S1_T1_C_cancel_leakage=3n
TEXT 240 1264 Left 2 ;.net I(Rload_S1) Vsource_S1\n.net I(RL) Vsource_S2
TEXT -3504 928 Left 2 !.inc /Models and subcircuits/lm7171.lib\n.inc /Models and subcircuits/lm7171_SN.lib\n.inc /Models and subcircuits/TLV271.lib

The netlist it stands for:
* Easy_RFPA_RevC_seS1.asc
R1 s1p 0 {Rs}
R2 dp N008 {Rfb}
C1 N008 g1p {Cfb}
R3 b1p N013 {Rgbias}
R4 g1p b1p {Rg_damp}
L1 b1p g1p {Lg_damp}
C2 b1p N010 {Csource}
V1 VD 0 {VD}
L3 VD dp {Ld}
RL OUT 0 {Rload_HV_SE}
V4 VGbias N004 PULSE({VG_init} {VG} {VG_tdelay} {VG_trise} {VG_trise} {VG_tpad*2+tpulse-VG_trise} 10m)
V2 t 0 SINE(0 {Vin} {f0} {VG_tdelay+VG_tpad} 0 0 {tpulse*f0}) AC 1 Rser=50
B1 N004 0 V=VG*smallsig()
B2 N005 0 V=V(OUT)
R17 OUT_bpf N005 {bpf_R}
L15 OUT_bpf 0 {bpf_L}
C9 OUT_bpf 0 {bpf_C}
XM1 N009 N011 N012 irf630  ; pins D G S
L17 N012 s1p {Lpar_S} Rpar={EPR_S}
L18 dp N009 {Lpar_D} Rpar={EPR_D}
L19 g1p N011 {Lpar_G} Rpar={EPR_G}
R18 s2p 0 {Rs}
R19 dp N014 {Rfb}
C10 N014 g2p {Cfb}
R20 b2p N019 {Rgbias}
R21 g2p b2p {Rg_damp}
L16 b2p g2p {Lg_damp}
C11 b2p N016 {Csource}
XM2 N015 N017 N018 irf630  ; pins D G S
L21 N018 s2p {Lpar_S} Rpar={EPR_S}
L22 dp N015 {Lpar_D} Rpar={EPR_D}
L23 g2p N017 {Lpar_G} Rpar={EPR_G}
R5 s1n 0 {Rs}
R6 dn N022 {Rfb}
C3 N022 g1n {Cfb}
R7 b1n N043 {Rgbias}
R8 g1n b1n {Rg_damp}
L2 b1n g1n {Lg_damp}
C4 b1n N032 {Csource}
L4 VD dn {Ld}
XM3 N025 N033 N034 irf630  ; pins D G S
L11 N034 s1n {Lpar_S} Rpar={EPR_S}
L12 dn N025 {Lpar_D} Rpar={EPR_D}
L13 g1n N033 {Lpar_G} Rpar={EPR_G}
R9 s2n 0 {Rs}
R10 dn N045 {Rfb}
C5 N045 g2n {Cfb}
R11 b2n N050 {Rgbias}
R12 g2n b2n {Rg_damp}
L14 b2n g2n {Lg_damp}
C6 b2n N047 {Csource}
XM4 N046 N048 N049 irf630  ; pins D G S
L25 N049 s2n {Lpar_S} Rpar={EPR_S}
L26 dn N046 {Lpar_D} Rpar={EPR_D}
L27 g2n N048 {Lpar_G} Rpar={EPR_G}
C7 t N036 100n
L204 0 N007 {T2_Lmag} Rser={T2_DCR} Rpar={T2_Rmag} Cpar={T2_Cp}
L203 N007 N006 {T2_Lmag} Rser={T2_DCR} Rpar={T2_Rmag} Cpar={T2_Cp}
L202 N006 N003 {T2_Lmag} Rser={T2_DCR} Rpar={T2_Rmag} Cpar={T2_Cp}
L201 N003 N002 {T2_Lmag} Rser={T2_DCR} Rpar={T2_Rmag} Cpar={T2_Cp}
L206 dn VD {T2_Lmag} Rser={T2_DCR} Rpar={T2_Rmag} Cpar={T2_Cp}
L205 VD dp {T2_Lmag} Rser={T2_DCR} Rpar={T2_Rmag} Cpar={T2_Cp}
C8 OUT N002 {T2_C_cancel_leakage}
R30 N013 VGbias {Rgbias2}
C12 N013 0 {Cgbias}
R31 N019 VGbias {Rgbias2}
C13 N019 0 {Cgbias}
R32 N043 VGbias {Rgbias2}
C14 N043 0 {Cgbias}
R33 N050 VGbias {Rgbias2}
C15 N050 0 {Cgbias}
E1 N001 0 VGbias 0 Laplace = {1+alpha_z*s*tau_z/(1+s*tau_z)}
XU1 N058 N054 VCC VEE N056 level.2 Avol=1Meg GBW=50Meg Slew=10Meg ilimit=1 rail=0 Vos=0 phimargin=45 en=0 enk=0 in=0 ink=0 Rin=500Meg  ; pins IN+ IN- V+ V- OUT
V3 VCC 0 15
R34 N054 s1p 10k
R35 N054 s2p 10k
R36 N054 s1n 10k
R37 N054 s2n 10k
V5 N060 N063 PULSE(0.001 {ID*Rs} {VG_tdelay} {VG_trise} {VG_trise} {VG_tpad*2+tpulse-VG_trise} 10m)
B3 N063 0 V=ID*Rs*smallsig()
R38 N055 N054 10k
R39 N058 N060 1k
C16 N056 N055 1n
V6 VEE 0 -5
R40 S1_s1p 0 {S1_Rs}
R41 S1_dp N028 {S1_Rfb}
C17 N028 S1_g1p {S1_Cfb}
R42 S1_b1p N044 {S1_Rgbias}
R43 S1_g1p S1_b1p {S1_Rg_damp}
L5 S1_b1p S1_g1p {S1_Lg_damp}
C18 N037 S1_b1p {S1_Csource}
L7 N040 S1_s1p {Lpar_S} Rpar={EPR_S}
L8 S1_dp N035 {Lpar_D} Rpar={EPR_D}
L9 S1_g1p N038 {Lpar_G} Rpar={EPR_G}
R54 N044 S1_VGbias {S1_Rgbias2}
C21 N044 0 {S1_Cgbias}
L304 N029 N023 {S1_T1_Lmag} Rser={S1_T1_DCR} Rpar={S1_T1_Rmag} Cpar={S1_T1_Cp}
L303 N023 N021 {S1_T1_Lmag} Rser={S1_T1_DCR} Rpar={S1_T1_Rmag} Cpar={S1_T1_Cp}
L302 N021 N020 {S1_T1_Lmag} Rser={S1_T1_DCR} Rpar={S1_T1_Rmag} Cpar={S1_T1_Cp}
L301 N020 VD {S1_T1_Lmag} Rser={S1_T1_DCR} Rpar={S1_T1_Rmag} Cpar={S1_T1_Cp}
L306 in1n 0 {S1_T1_Lmag} Rser={S1_T1_DCR} Rpar={S1_T1_Rmag} Cpar={S1_T1_Cp}
L305 0 in1p {S1_T1_Lmag} Rser={S1_T1_DCR} Rpar={S1_T1_Rmag} Cpar={S1_T1_Cp}
XU2 N057 N051 VCC VEE N053 level.2 Avol=1Meg GBW=50Meg Slew=10Meg ilimit=1 rail=0 Vos=0 phimargin=45 en=0 enk=0 in=0 ink=0 Rin=500Meg  ; pins IN+ IN- V+ V- OUT
R56 N051 S1_s1p 10k
V7 N059 N062 PULSE(0.001 {S1_ID*S1_Rs} {VG_tdelay} {VG_trise} {VG_trise} {VG_tpad*2+tpulse-VG_trise} 10m)
B4 N062 0 V=S1_ID*S1_Rs*smallsig()
R60 N052 N051 1k
R61 N057 N059 1k
C23 N053 N052 1n
L29 VD S1_dp 22µ
XM7 N035 N038 N040 irf510_IRF  ; pins D G S
Rload_S1 0 0 50
V8 S1_VGbias N061 PULSE({VG_init} {S1_VG} {VG_tdelay} {VG_trise} {VG_trise} {VG_tpad*2+tpulse-VG_trise} 10m)
B5 N061 0 V=S1_VG*smallsig()
Vsource_S1 0 0 0 AC 1 Rser=50
Vsource_S2 0 0 0 AC 1 Rser=50
XX3 in1p N010 0 atten Rin=12.5 Rout=12.5 dB=3  ; pins IN OUT REF
XX1 in1p N016 0 atten Rin=12.5 Rout=12.5 dB=3  ; pins IN OUT REF
XX4 in1n N032 0 atten Rin=12.5 Rout=12.5 dB=3  ; pins IN OUT REF
XX5 in1n N047 0 atten Rin=12.5 Rout=12.5 dB=3  ; pins IN OUT REF
XX2 S1_in1p N037 0 atten Rin=50 Rout=50 dB=0.01  ; pins IN OUT REF
V10 vcc_24 0 24
R13 N027 N026 300
R14 N026 N036 100
C19 N027 N026 10p
R16 vcc_24 N041 10k
R22 N041 0 10K
C20 0 N041 100n
C22 N039 N027 100n
R23 0 t 100
XU3 N041 N026 vcc_24 0 N027 level.2 Avol=5.6K GBW=160Meg Slew=100Meg ilimit=120m rail=0 Vos=0 phimargin=45 en=0 enk=0 in=0 ink=0 Rin=500Meg  ; pins IN+ IN- V+ V- OUT
V9 N024 0 SINE(0 {Vin} {f0} {VG_tdelay+VG_tpad} 0 0 {tpulse*f0}) AC 2 Rser=50
R24 N031 N030 300
R25 N030 N039 100
R26 N042 N031 50
C24 N031 N030 10p
C25 S1_in1p N042 100n
XU4 N041 N030 vcc_24 0 N031 level.2 Avol=5.6K GBW=160Meg Slew=100Meg ilimit=120m rail=0 Vos=0 phimargin=45 en=0 enk=0 in=0 ink=0 Rin=500Meg  ; pins IN+ IN- V+ V- OUT
C26 N029 S1_dp 22n
; main simulation statement
; choose either AC or TRAN
;.ac dec 1k 100k 200meg;
;tran 0 {VG_tdelay+VG_tpad+tsettle_startlog+logperiods/f0} {VG_tdelay+VG_tpad+tsettle_startlog}
.tran 0 {VG_tdelay+VG_tpad+tsettle_startlog+logperiods/f0} {VG_tdelay+VG_tpad+tsettle_startlog} 50n
; derive two port network parameters for AC analysis (can be left active when doing TRAN)
.net I(RL) V2
.OPTIONS reltol=0.0001
; SPICE models/subcircuits to include
.inc /Models and subcircuits/all_hexfet_subcircuits.inc
; FOR MEASURING COMPRESSION
;.step oct param Vin_scale 0.0625 1 4
.meas TRAN Vout_RMS_fund RMS V(OUT_bpf)
;.meas TRAN Av_fund RMS {V(OUT_bpf)/(Vin/1.414/2)}
.meas TRAN Av_fund PARAM Vout_RMS_fund/(Vin/1.414/2)
.meas TRAN Pout_fund PARAM (Vout_RMS_fund**2/Rload_HV_SE)
.meas TRAN G_dB PARAM 20*log10(Av_fund)
.meas TRAN Pbias AVG -V(VD)*I(V1)
.meas TRAN Efficiency PARAM Pout_fund/Pbias
.meas TRAN S2_Vout_RMS_fund RMS V(OUT_bpf)
.meas TRAN S1_Vout_RMS_fund RMS V(S1_dp,VD)
.meas TRAN S1_Vin_RMS_fund RMS V(t)
.meas TRAN S2_Av_fund PARAM S2_Vout_RMS_fund/(S1_Vout_RMS_fund)
.meas TRAN S1_Av_fund PARAM S1_Vout_RMS_fund/(Vin/1.414/2)
.meas TRAN S1_G_dB PARAM 20*log10(S1_Av_fund)
.meas TRAN S2_G_dB PARAM 20*log10(S2_Av_fund)
* trace formulas
* Transconductance of FET Gm0
* Ix(M1:D)/V(g,s)
* Effective transconductance Gm
* Ix(M1:D)/V(g)
* Stability factor
* (1-abs(S11(v2))**2-abs(S22(v2))**2+abs(S11(v2)*S22(v2)-S12(v2)*S21(v2))**2)/(2*abs(S21(v2)*S12(v2)))
* just delta
* S11(v2)*S22(v2)-S12(v2)*S21(v2)
;step 1: choose some basic specifications
; the target overall PEP
.param PEPnet_watts_target=200
; choose how many pull-pull pairs will be in parallel
.param Npar=2
; the intended center frequency
.param f0=5.1meg
.param w0={2*pi*f0}
; the bias voltage VD
.param VD=48
; define the nominal source/load impedances on the single-ended input/output
.param Rsource_HV_SE=50
.param Rload_HV_SE=50
; step 2: determine input/output balun turn ratios
; low voltage, center tapped sides
.param KOUT_N_LV=1
.param KIN_N_LV=1
; high voltage, single ended sides
.param KOUT_N_HV=4
.param KIN_N_HV=4
;step 3:
.param ID=3.1
.param Rs=0.707
.param VG={ID*Rs+Vth}
;step 4:
.param Rgbias=100
.param Rgbias2=10
.param Cgbias=3.3n
.param Rfb=150
;step 5: choose components that influence frequency response
.param Cfb=2.2n
.param Csource=27n
.param Ld=3.3u
; step 6: design equations for a pi attenuator
.param atten_Rshunt_in=75
.param atten_Rshunt_out=75
.param atten_Rser=4.99
; step 7: define parasitics on power FETs
.param Lpar_S=7.5n
.param EPR_S=100
.param Lpar_D=4.5n
.param EPR_D=100
.param Lpar_G=7.5n
.param EPR_G=100
; choose the damping network values
.param Rg_damp=15
.param Lg_damp=47n
* ;.meas PEP PARAM {PEP}
* .meas VD PARAM {VD}
* ;.meas VDmin PARAM {VDmin}
* ;.meas amp_Rload PARAM {amp_Rload}
* ;.meas IDmin PARAM {IDmin}
* .meas ID PARAM {ID}
* .meas Gm0 PARAM {Gm0}
* ;.meas Gm PARAM {Gm}
* .meas Rs PARAM {Rs}
* .meas Rgbias PARAM {Rgbias}
* ;.meas amp_Rsource PARAM {amp_Rsource}
* .meas Rfb PARAM {Rfb}
* .meas Cfb PARAM {Cfb}
* .meas Csource PARAM {Csource}
* ;.meas amp_Rin_target PARAM {amp_Rin_target}
* ;.meas amp_Rin PARAM {amp_Rin}
* .meas VG PARAM {VG}
* .meas Coss PARAM {Coss}
* .meas Ld PARAM {Ld}
* ;.meas KIN_LP PARAM {KIN_LP}
* ;.meas KIN_LS PARAM {KIN_LS}
* ;.meas KOUT_LP PARAM {KOUT_LP}
* ;.meas KOUT_LS PARAM {KOUT_LS}
* .meas Rload_HV_SE PARAM {Rload_HV_SE}
* .meas Rsource_HV_SE PARAM {Rsource_HV_SE}
; pulse shape, for tran simulations
.param tpulse=200u
.param VG_tpad=50u
.param VG_trise=5u
.param VG_tdelay=50u
.param VG_init = 0
.param tsettle_startlog=50u
.param logperiods=2
.param bpf_w0={w0}
.param bpf_R=100
.param bpf_Q=10
.param bpf_C={bpf_Q/(bpf_w0*bpf_R)}
.param bpf_L={bpf_R/(bpf_Q*bpf_w0)}
* BPF for measuring fundamental
* component of RFPA output
* Input/output transformer baluns
; choose the approximate properties of the power FETs
;.include /FET_bias_conditions/fetprops_irf510_ID_1p0.inc
;.include /FET_bias_conditions/fetprops_irf520_ID_1p0.inc
;.include /FET_bias_conditions/fetprops_irf520n_ID_1p0.inc
;.include /FET_bias_conditions/fetprops_irf530_ID_1p0.inc
;.include /FET_bias_conditions/fetprops_irf530n_ID_1p0.inc
;.include /FET_bias_conditions/fetprops_irf540n_ID_1p0.inc
;.include /FET_bias_conditions/fetprops_irf630_ID_1p0.inc
;.include /FET_bias_conditions/fetprops_irf630n_ID_1p0.inc
;.include /FET_bias_conditions/fetprops_irf510_ID_3p1.inc
;.include /FET_bias_conditions/fetprops_irf520_ID_3p1.inc
;.include /FET_bias_conditions/fetprops_irf520n_ID_3p1.inc
;.include /FET_bias_conditions/fetprops_irf530_ID_3p1.inc
;.include /FET_bias_conditions/fetprops_irf530n_ID_3p1.inc
;.include /FET_bias_conditions/fetprops_irf540n_ID_3p1.inc
.include /FET_bias_conditions/fetprops_irf630_ID_3p1.inc
;.include /FET_bias_conditions/fetprops_irf630n_ID_3p1.inc
; define the rollet stability factor K
.func kstab(S11,S21,S12,S22) {(1-abs(S11)**2-abs(S22)**2+abs(S11*S22-S12*S21)**2)/(2*abs(S21*S12))}
; measurements of AC response
; get some network parameters at f0
.meas f0 PARAM {f0}
.meas AC S21_at_f0 FIND mag(S21(v2)) AT f0
.meas AC S11_at_f0 FIND mag(S11(v2)) AT f0
.meas AC S22_at_f0 FIND mag(S22(v2)) AT f0
.meas AC kstab_at_f0 FIND kstab(S11(v2),S21(v2),S12(v2),S22(v2)) AT f0
;also give Zin and Zout at f0. But output will be in dB/phase....
.meas AC Zin_at_f0 FIND mag(Zin(v2)) AT f0
.meas AC Zout_at_f0 FIND mag(Zout(v2)) AT f0
; find the actual peak of S21
.MEAS AC S21_at_S21_max max mag(S21(v2)); find the peak response
.MEAS AC f_at_S21_max when mag(S21(v2))=(S21_at_S21_max)
; find the minimum kstab
.MEAS AC kstab_at_stab_min min kstab(S11(v2),S21(v2),S12(v2),S22(v2))
.MEAS AC f_at_kstab_min when kstab(S11(v2),S21(v2),S12(v2),S22(v2))=(kstab_at_stab_min)
.param T2_Lmag=12.59u
.param T2_Cp={804p/6}
.param T2_K=0.997
.param T2_Rmag={1.099K*6}
.param T2_DCR=0.33
K200 L201 L202 L203 L204 L205 L206 {T2_K}
.param T2_C_cancel_leakage=3n
.param T1_Lmag=12.59u
.param T1_Cp={804p/6}
.param T1_K=0.997
.param T1_Rmag={1.099K*6}
.param T1_DCR=0.33
;K100 L101 L102 L103 L104 L105 L106 {T1_K}
.param T1_C_cancel_leakage=3n
.param Vin={2*0.223*sqrt(2)*Vin_scale}
.param Vin_scale=1
.param tau_z=2.2u
.param alpha_z=0.7
;step 3:
.param S1_ID=1.5
.param S1_Rs=1.5
;.param S1_Vth=5.01; for IRF510 at 1A
.param S1_Vth=5.34; for IRF510 at 1.5A
.param S1_VG={S1_ID*S1_Rs+S1_Vth}
;step 4:
.param S1_Rgbias=500
.param S1_Rgbias2=10
.param S1_Cgbias=1n
.param S1_Rfb=1200
;step 5: choose components that influence frequency response
.param S1_Cfb=1n
.param S1_Csource=4.7n
.param S1_Ld=3.3u
; step 6: design equations for a pi attenuator
.param S1_atten_Rshunt_in=75
.param S1_atten_Rshunt_out=75
.param S1_atten_Rser=4.99
; choose the damping network values
.param S1_Rg_damp=15
.param S1_Lg_damp=47n
.param S1_T1_Lmag=12.59u
.param S1_T1_Cp={804p/6}
.param S1_T1_K=0.997
.param S1_T1_Rmag={1.099K*6}
.param S1_T1_DCR=0.33
K300 L301 L302 L303 L304 L305 L306 {T1_K}
.param S1_T1_C_cancel_leakage=3n
* .net I(Rload_S1) Vsource_S1
* .net I(RL) Vsource_S2
.inc /Models and subcircuits/lm7171.lib
.inc /Models and subcircuits/lm7171_SN.lib
.inc /Models and subcircuits/TLV271.lib
.lib UniversalOpamps2.sub
.backanno
.end